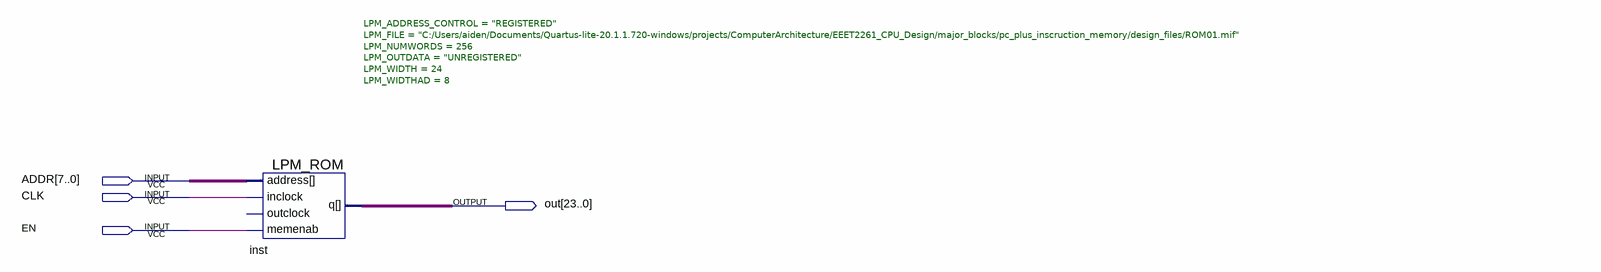
[diagram p0: schematic sheet]
// Quartus schematic instruction_memory.bdf as structural Verilog: 1 symbols, 4 pins
module instruction_memory (
  input  [7:0] ADDR,
  input  CLK,
  input  EN,
  output [23:0] out
);

  LPM_ROM #(.LPM_ADDRESS_CONTROL("REGISTERED"), .LPM_FILE("C:/Users/aiden/Documents/Quartus-lite-20.1.1.720-windows/projects/ComputerArchitecture/EEET2261_CPU_Design/major_blocks/pc_plus_inscruction_memory/design_files/ROM01.mif"), .LPM_NUMWORDS(256), .LPM_OUTDATA("UNREGISTERED"), .LPM_WIDTH(24), .LPM_WIDTHAD(8)) inst (
    .address(ADDR), .inclock(CLK), .memenab(EN), .q(out));  // open: outclock
endmodule
